# EAGLE design Voltage Reg Comparison (EAGLE 6.5.0)
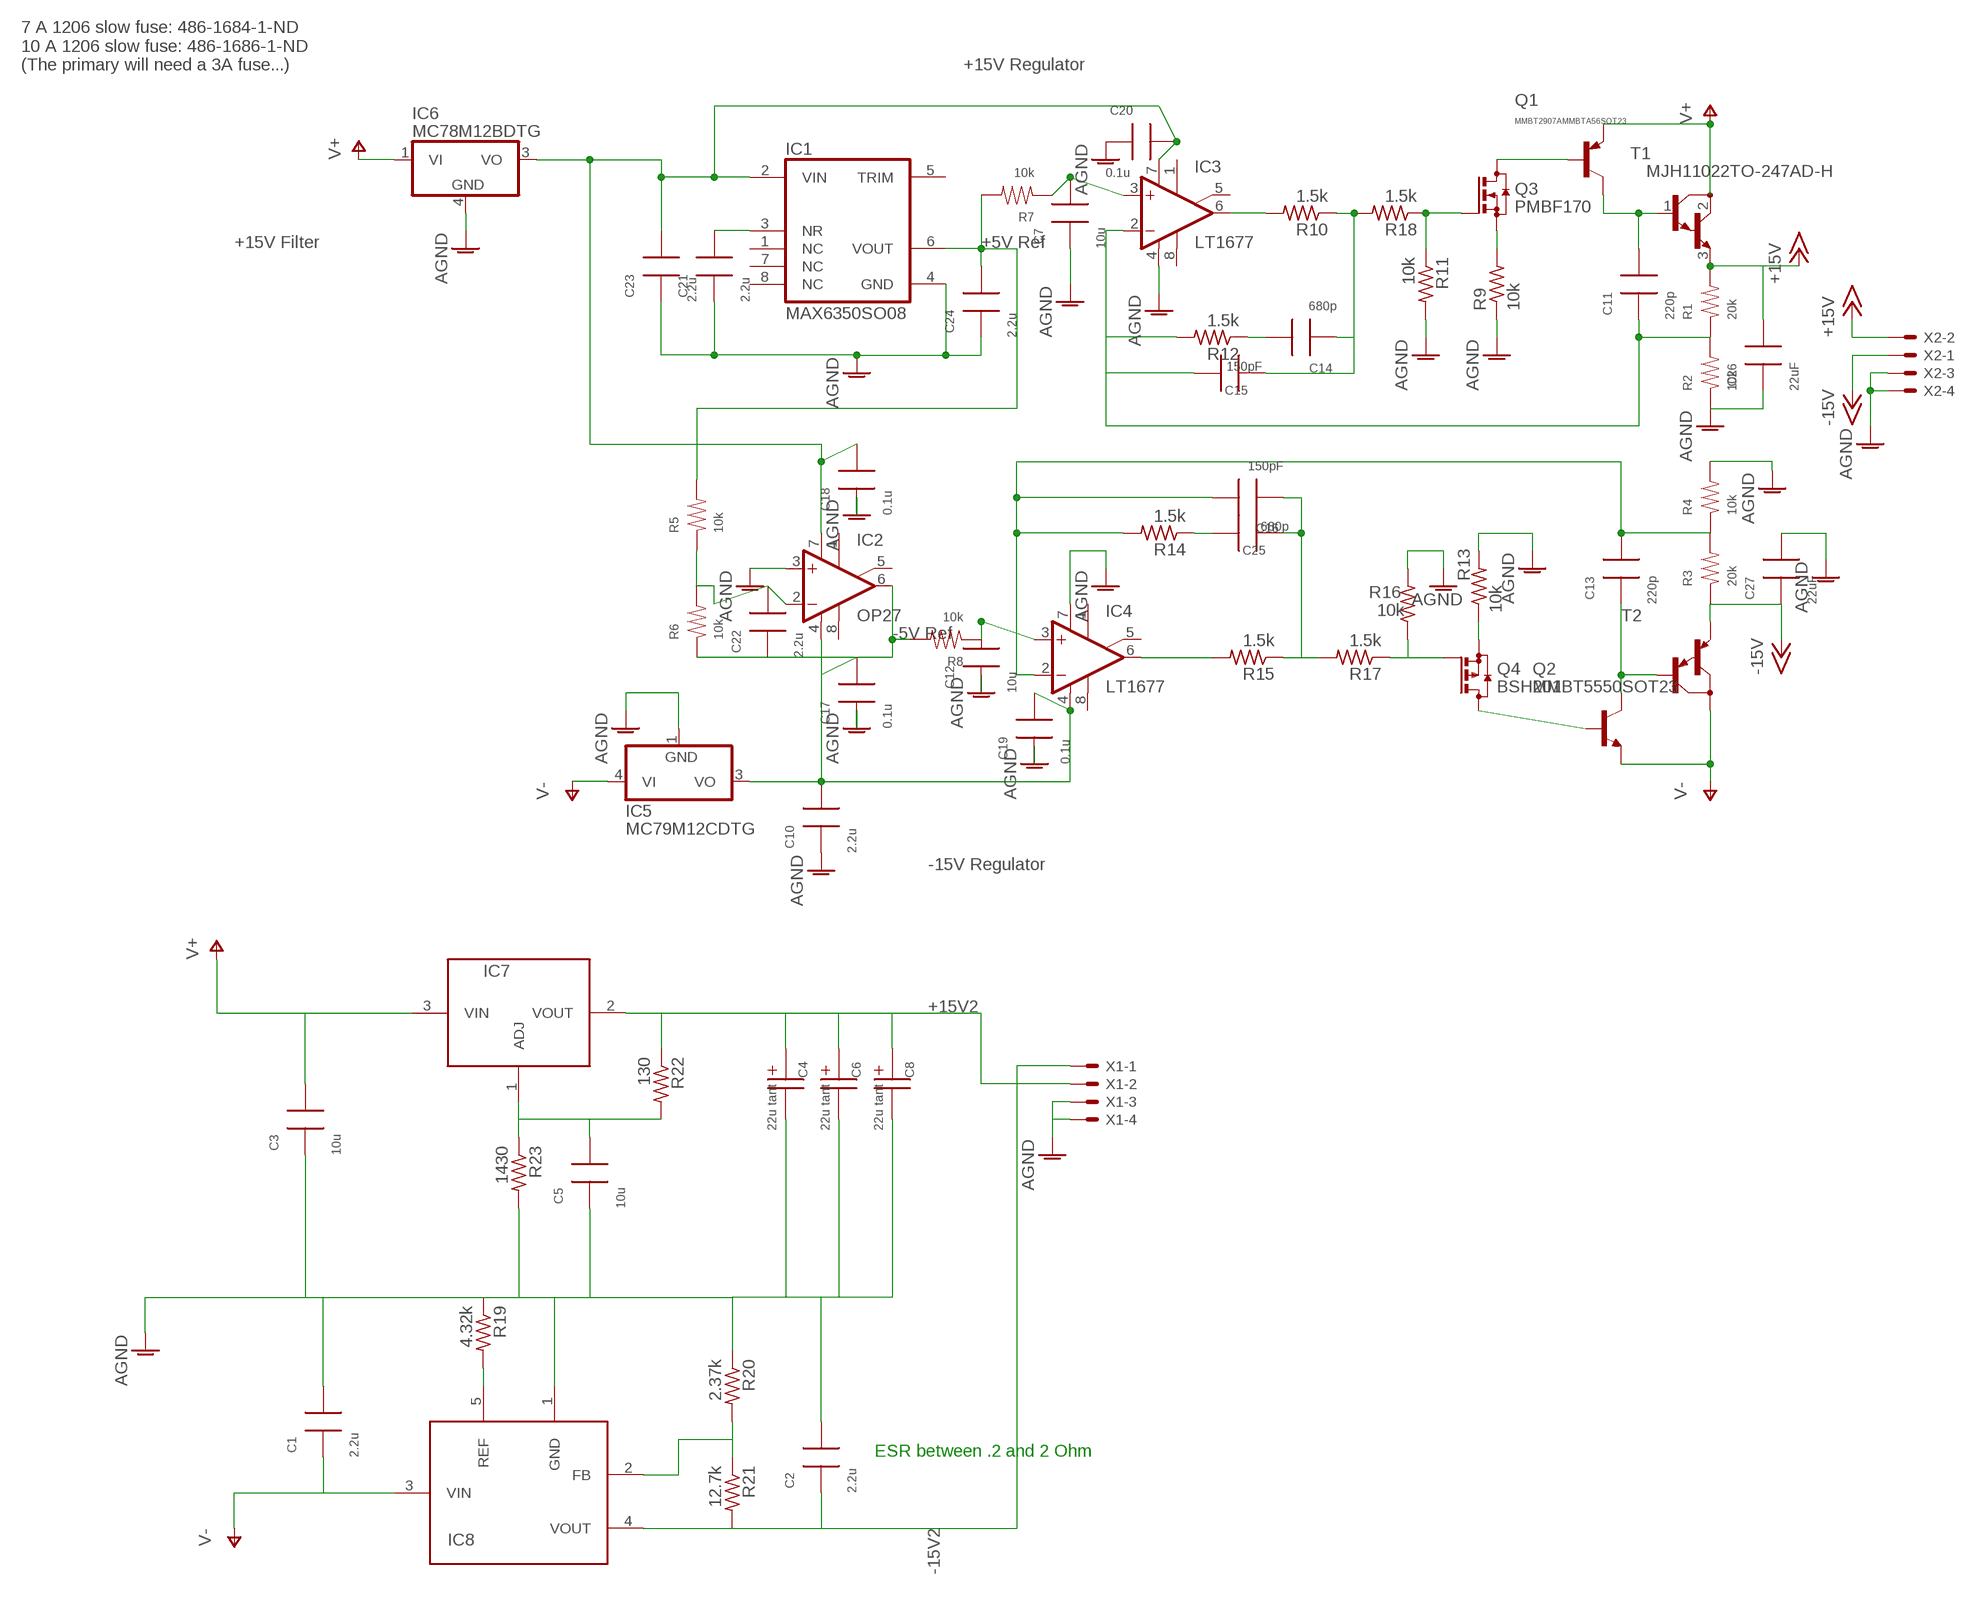
[diagram p0: schematic, sheet 1]

## Parts
C1  2.2u  CAP1206  [1206]
C2  2.2u  CAP1206  [1206]
C3  10u  CAP1206  [1206]
C4  22u tant  CAP-POL1206  [1206P]
C5  10u  CAP1206  [1206]
C6  22u tant  CAP-POL1206  [1206P]
C7  10u  CAP1206  [1206]
C8  22u tant  CAP-POL1206  [1206P]
C10  2.2u  CAP1206  [1206]
C11  220p  CAP1206  [1206]
C12  10u  CAP1206  [1206]
C13  220p  CAP1206  [1206]
C14  680p  CAP1206  [1206]
C15  150pF  CAP1206  [1206]
C16  150pF  CAP1206  [1206]
C17  0.1u  CAP1206  [1206]
C18  0.1u  CAP1206  [1206]
C19  0.1u  CAP1206  [1206]
C20  0.1u  CAP1206  [1206]
C21  2.2u  CAP1206  [1206]
C22  2.2u  CAP1206  [1206]
C23  2.2u  CAP1206  [1206]
C24  2.2u  CAP1206  [1206]
C25  680p  CAP1206  [1206]
C26  22uF  CAP1206  [1206]
C27  22uF  CAP1206  [1206]
IC1  MAX6350SO08  [SO08]
IC2  OP27  OPAMP-SO  [SO08]
IC3  LT1677  OPAMP-SO  [SO08]
IC4  LT1677  OPAMP-SO  [SO08]
IC5  MC79M12CDTG  [DPACK_3]
IC6  MC78M12BDTG  [DPACK_3]
IC7  LM1084TO220  [T03B]
IC8  LT1185TO220/INLINE  [T05A]
Q1  MMBT2907AMMBTA56SOT23  [SOT23]
Q2  MMBT5550SOT23  [SOT23]
Q3  PMBF170  [SOT23]
Q4  BSH201  [SOT23]
R1  20k  RES1206  [1206]
R2  10k  RES1206  [1206]
R3  20k  RES1206  [1206]
R4  10k  RES1206  [1206]
R5  10k  RES1206  [1206]
R6  10k  RES1206  [1206]
R7  10k  RES1206  [1206]
R8  10k  RES1206  [1206]
R9  10k  R-US_R1206  [R1206]
R10  1.5k  R-US_R1206  [R1206]
R11  10k  R-US_R1206  [R1206]
R12  1.5k  R-US_R1206  [R1206]
R13  10k  R-US_R1206  [R1206]
R14  1.5k  R-US_R1206  [R1206]
R15  1.5k  R-US_R1206  [R1206]
R16  10k  R-US_R1206  [R1206]
R17  1.5k  R-US_R1206  [R1206]
R18  1.5k  R-US_R1206  [R1206]
R19  4.32k  R-US_R1206  [R1206]
R20  2.37k  R-US_R1206  [R1206]
R21  12.7k  R-US_R1206  [R1206]
R22  130  R-US_R1206  [R1206]
R23  1430  R-US_R1206  [R1206]
T1  MJH11022TO-247AD-H  [TO-247AD-H]
T2  MJH11021TO-247AD-H  [TO-247AD-H]
X1  5566-4RA  [5566-4-RA]
X2  5566-4RA  [5566-4-RA]

## Nets
+12V: C18.2 C20.2 C23.2 IC1.2(VIN) IC2.7(V+) IC3.7(V+) IC6.3(VO)
+15V: C26.2 R1.2 T1.3(E) X2.2
+15V2: C4.1 C6.1 C8.1 IC7.2(VOUT) R22.1 X1.2
-12V: C10.2 C17.2 C19.2 IC2.4(V-) IC4.4(V-) IC5.3(VO)
-15V: C27.1 R3.1 T2.3(E) X2.1
-15V2: C2.1 IC8.4(VOUT) R21.2 X1.1
AGND: C1.2 C2.2 C3.1 C4.2 C5.1 C6.2 C7.1 C8.2 C10.1 C12.1 C17.1 C18.1 C19.1 C20.1 C21.1 C23.1 C24.1 C26.1 C27.2 IC1.4(GND) IC2.3(+IN) IC3.4(V-) IC4.7(V+) IC5.1(GND) IC6.4(GND) IC8.1(GND) R2.1 R4.2 R9.1 R11.2 R13.2 R16.2 R19.1 R20.1 R23.2 X1.3 X1.4 X2.3 X2.4
N$1: IC8.2(FB) R20.2 R21.1
N$2: C5.2 IC7.1(ADJ) R22.2 R23.1
N$4: C21.2 IC1.3(NR)
N$7: C24.2 IC1.6(VOUT) R5.2 R7.2
N$9: C14.2 R12.1
N$10: C13.1 Q2.3(C) T2.1(B)
N$11: IC3.6(OUT) R10.2
N$12: Q4.1(G) R16.1 R17.1
N$13: C11.2 Q1.3(C) T1.1(B)
N$14: C22.2 IC2.2(-IN) R5.1 R6.2
N$15: C22.1 IC2.6(OUT) R6.1 R8.2
N$16: Q4.2(S) R13.1
N$17: C11.1 C15.2 IC3.2(-IN) R1.1 R2.2 R12.2
N$18: IC4.6(OUT) R15.2
N$19: C7.2 IC3.3(+IN) R7.1
N$20: Q2.1(B) Q4.3(D)
N$21: C12.2 IC4.3(+IN) R8.1
N$22: IC8.5(REF) R19.2
N$23: C13.2 C16.2 IC4.2(-IN) R3.2 R4.1 R14.2
N$25: Q3.1(G) R11.1 R18.1
N$27: C25.2 R14.1
N$28: C16.1 C25.1 R15.1 R17.2
N$33: Q1.1(B) Q3.3(D)
N$34: Q3.2(S) R9.2
N$35: C14.1 C15.1 R10.1 R18.2
V+: IC6.1(VI) Q1.2(E) T1.2(C)
V+2: C3.2 IC7.3(VIN) ; supply symbol labelled V+
V-: IC5.4(VI) Q2.2(E) T2.2(C)
V-2: C1.1 IC8.3(VIN) ; supply symbol labelled V-
Unconnected: IC1.1(NC) IC1.5(TRIM) IC1.7(NC) IC1.8(NC) IC2.1(ON1) IC2.5(ON2) IC2.8(OPT) IC3.1(ON1) IC3.5(ON2) IC3.8(OPT) IC4.1(ON1) IC4.5(ON2) IC4.8(OPT)

## Notes on the sheet
- 7 A 1206 slow fuse: 486-1684-1-ND
  10 A 1206 slow fuse: 486-1686-1-ND
  (The primary will need a 3A fuse...)
- +15V Regulator
- +15V Filter | +5V Ref
- -5V Ref
- -15V Regulator
- ESR between .2 and 2 Ohm

## Library data of the parts
C1-C3 C5 C17-C20 = rlc-jqi:CAP: SMT Capacitor; DIGIKEY: 399-1249-1-ND
C4 C6 C8 = rlc-jqi:CAP-POL: Polarized SMT Capacitor; DIGIKEY: 399-1249-1-ND
C7 C12 = rlc-jqi:CAP: SMT Capacitor; DIGIKEY: 445-12883-2-ND; VMAX: 50
C10 C21-C24 = rlc-jqi:CAP: SMT Capacitor; DIGIKEY: 587-2402-1-ND
C11 C13 = rlc-jqi:CAP: SMT Capacitor; DIGIKEY: 1276-1166-1-ND
C14 C25 = rlc-jqi:CAP: SMT Capacitor; DIGIKEY: 399-8209-1-ND
C15 C16 = rlc-jqi:CAP: SMT Capacitor
C26 C27 = rlc-jqi:CAP: SMT Capacitor; DIGIKEY: 445-8045-1-ND
IC1 = jqi-power-supply:MAX6350: VOLATAGE REFERENCE; DIGIKEY: MAX6350CSA+-ND
IC2 = opamp-jqi:OPAMP: Basic Op Amp. Be sure to check actual pinout of your device, and modify as necessary!; DIGIKEY: OP27GSZ-REEL7CT-ND
IC3 IC4 = opamp-jqi:OPAMP: Basic Op Amp. Be sure to check actual pinout of your device, and modify as necessary!; DIGIKEY: LT1677CS8#PBF-ND
IC5 = linear:MC79M: 500 mA Negative Voltage Regulators Source: Data sheet <http://www.onsemi.com/pub_link/Collateral/MC79M00-D.PDF>; DIGIKEY: MC79M12CDTGOS-ND
IC6 = linear:MC78M: 500 mA Positive Voltage Regulators Source: Data sheet <http://www.onsemi.com/pub_link/Collateral/MC78M00-D.PDF>; DIGIKEY: MC78M12BDTGOS-ND
IC7 = jqi-power-supply:LM1084: Adjustable 5A Positive Voltage Regulator; DIGIKEY: LM1084IT-ADJ/NOPB-ND
IC8 = jqi-power-supply:LT1185: Adjustable Voltage Regulator (positive/negative); DIGIKEY: LT1185CT#06PBF-ND
Q1 = jqi-power-supply:MMBT2907A: PNP Transistor; DIGIKEY: MMBT2907AFSCT-ND
Q2 = jqi-power-supply:MMBT5550: NPN Transistor; DIGIKEY: MMBT5550CT-ND
Q3 = jqi-power-supply:PMBF170: N-CHANNEL MOS FET; DIGIKEY: MMBT2907AFSCT-ND
Q4 = jqi-power-supply:BSH201: P-CHANNEL MOS FET; DIGIKEY: 568-6217-1-ND
R1 R3 = rlc-jqi:RES: SMT Resistor; DIGIKEY: RMCF1206FT20K0CT-ND
R2 R4-R8 = rlc-jqi:RES: SMT Resistor; DIGIKEY: RNCP1206FTD10K0CT-ND
R9 R13 = rcl:R-US_: RESISTOR, American symbol; DIGIKEY: RNCP1206FTD10K0CT-ND
R10-R12 R14-R23 = rcl:R-US_: RESISTOR, American symbol; DIGIKEY: 541-1.5KECT-ND
T1 = jqi-power-supply:MJH11022: NPN POWER DARLINGTON TRANSISTOR 15A, 250V; DIGIKEY: MJH11022GOS-ND
T2 = jqi-power-supply:MJH11021: PNP POWER DARLINGTON TRANSISTOR 15A, 250V; DIGIKEY: MJH11021GOS-ND
X1 X2 = jqi-power-supply:5566-4: Mini FIT connector 4 pol Source: http://www.molex.com; DIGIKEY: WM1352-ND

## Board
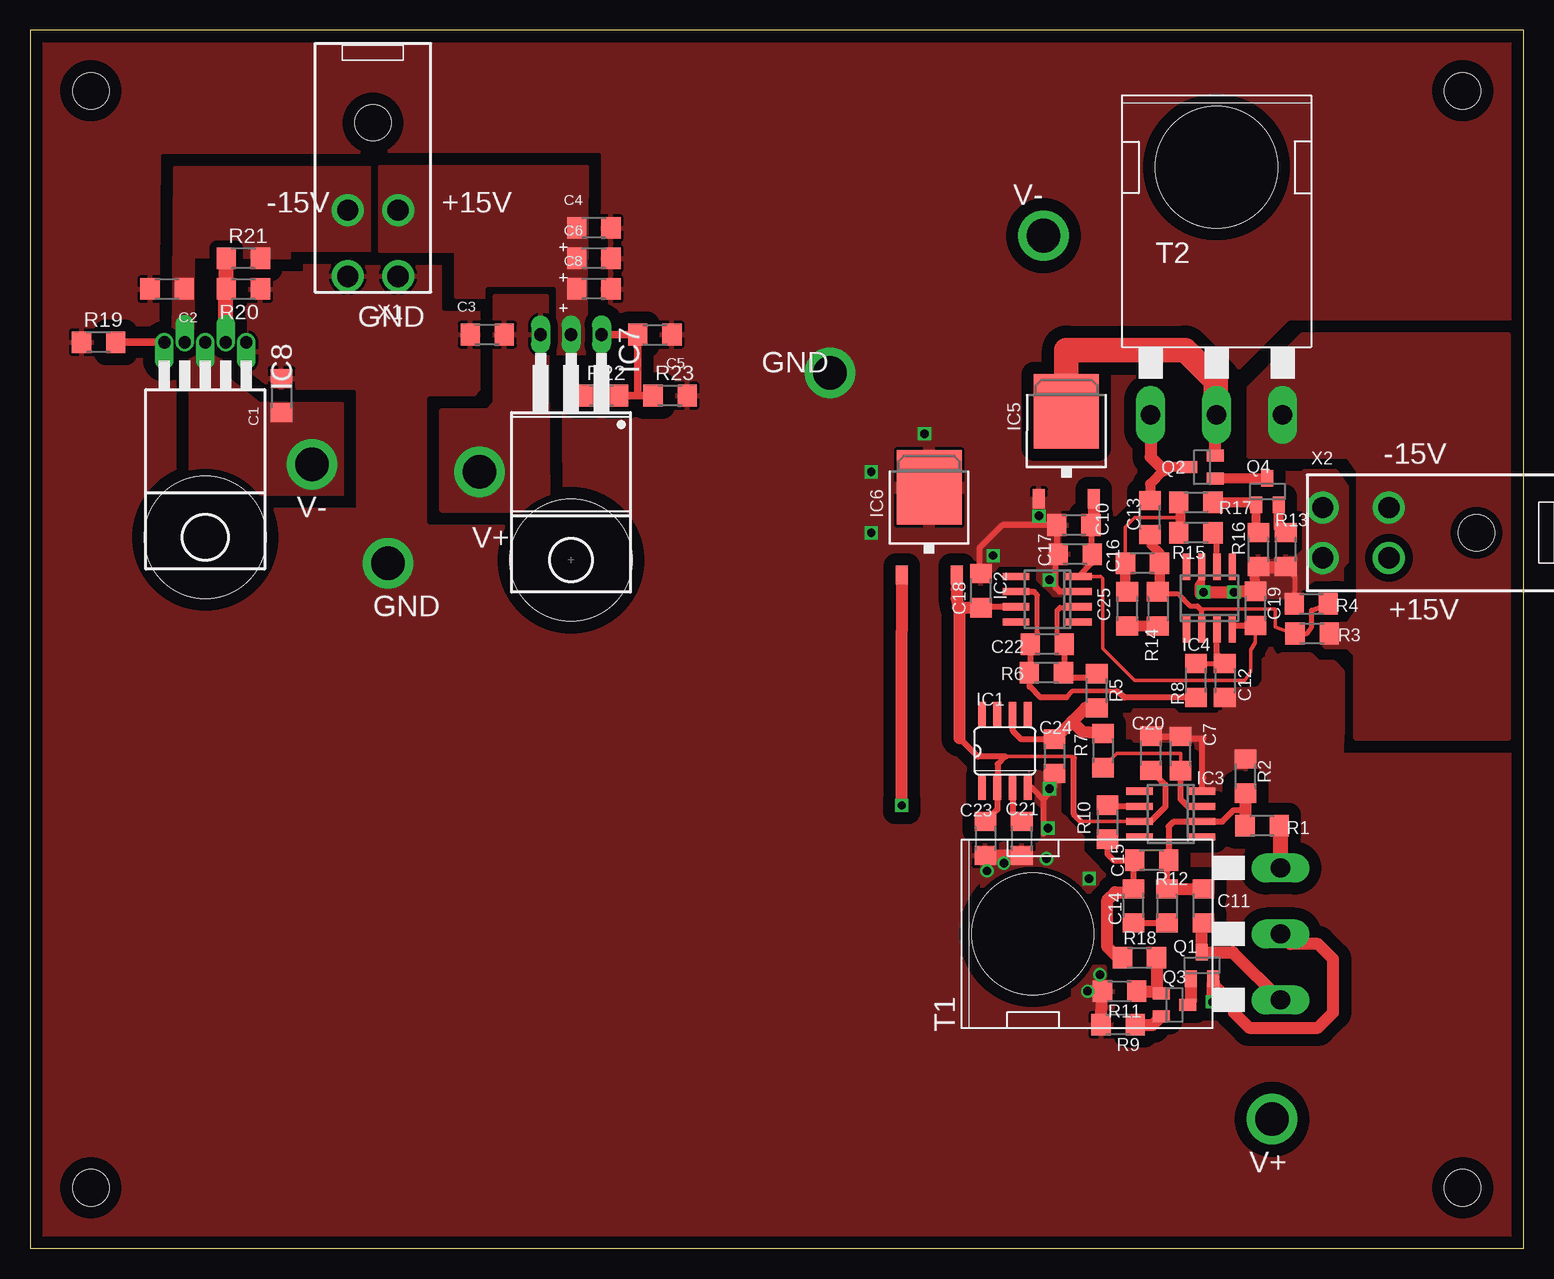
[diagram p1: board, top side]
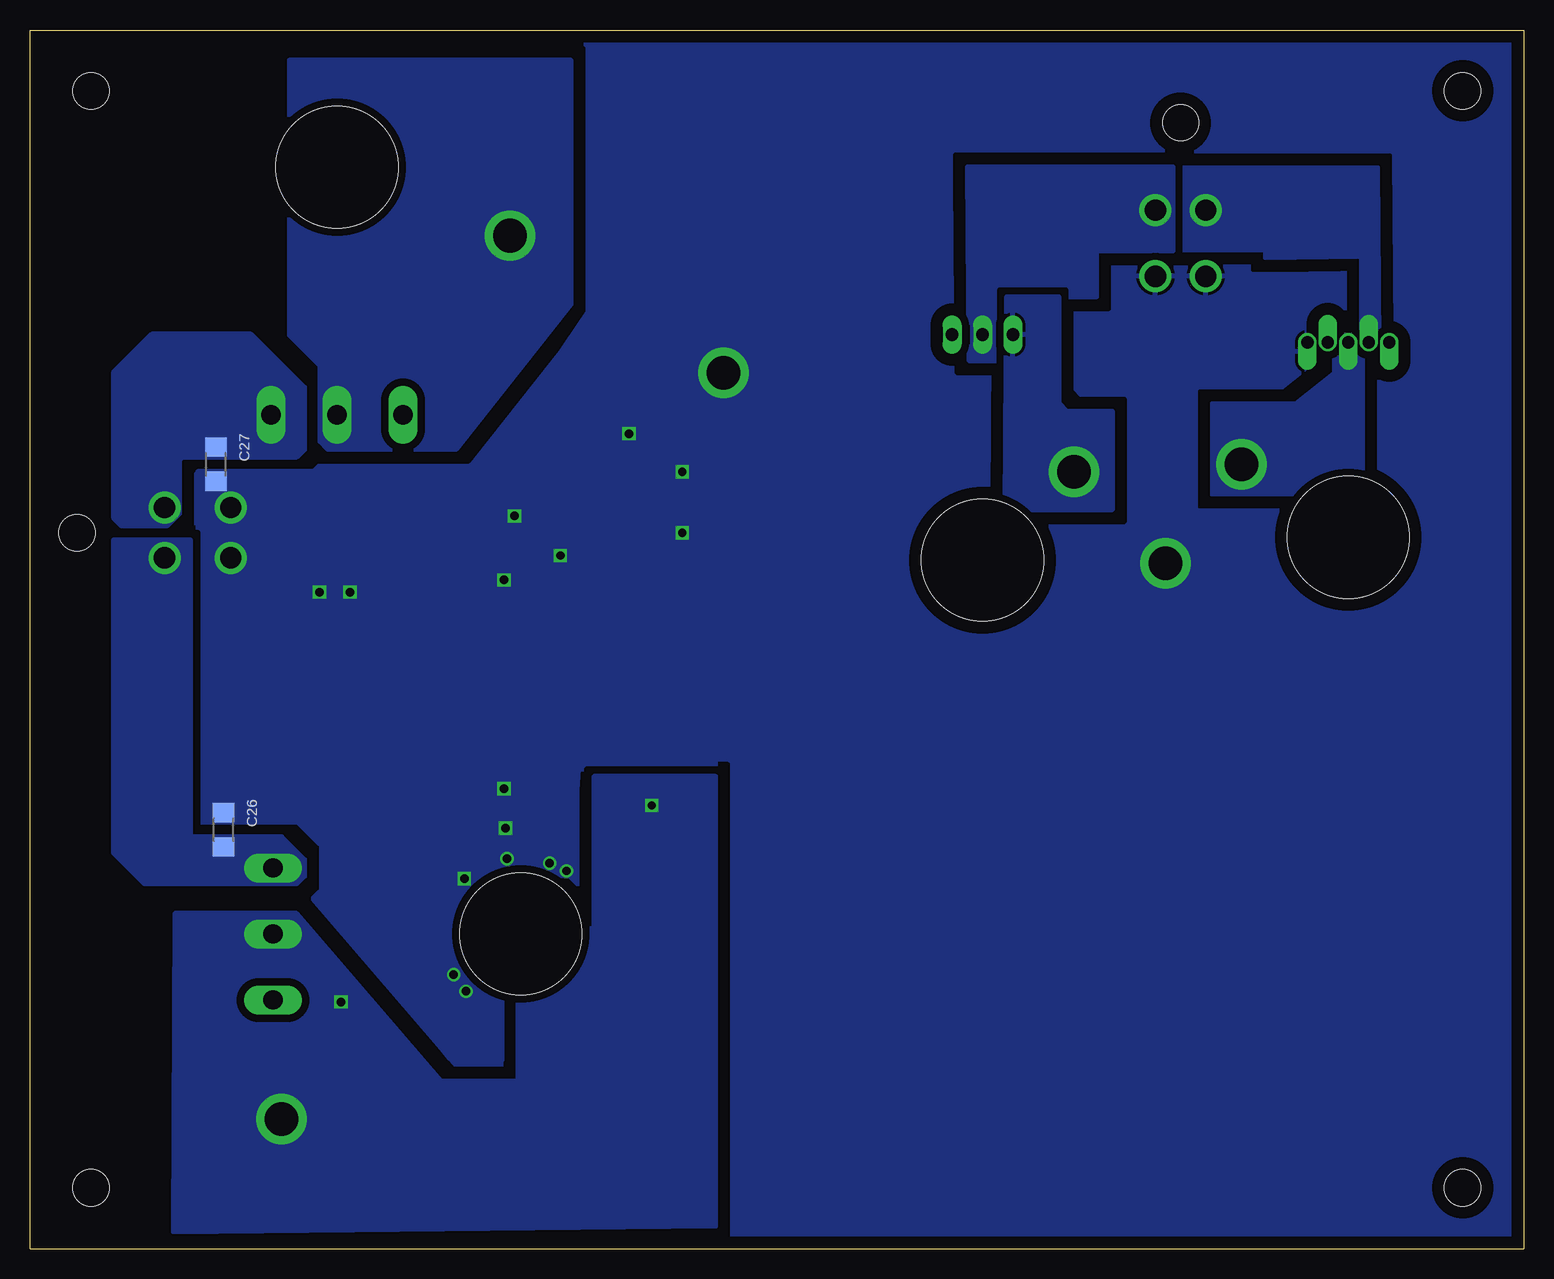
[diagram p2: board, bottom side, seen from below]

Size 124.46 x 101.6 mm. Coordinates in mm from the lower left corner, seen from the top.
Outline: 124.46,0 124.46,101.6 0,101.6 0,0 124.46,0
Copper layers (1+2*15+16): Top 0.0178mm / dielectric 12mil / Route2 0.0356mm / dielectric 28mil / Route15 0.0356mm / dielectric 12mil / Bottom 0.0178mm
Design rules "SSC-EAGLE-4Lyr_v1.0.0.3": minimum track width 6mil, minimum drill 8mil, track to track 6mil, track to pad 6mil, pad to pad 6mil, via to via 6mil, smd to smd 6mil, copper to edge 20mil, drill to drill 16mil, minimum pad ring 8mil, minimum via ring 8mil, stop-mask expansion 3mil, vias tented up to drill 0mil, thermal gap 10mil
Holes 3.05 mm at 119.38,5.08 119.38,96.52 5.08,96.52 5.08,5.08

### Footprints (pad centres in the part's own frame; a part is rotated, then mirrored left to right if it is on the bottom)
1206 = smd 1.6 x 1.803: 1 -1.422,0; 2 1.422,0
1206P = smd 1.6 x 1.803: 1 -1.422,0; 2 1.422,0
SO08 = smd 0.66 x 2.032: 1 -1.905,-3.073; 2 -0.635,-3.073; 3 0.635,-3.073; 4 1.905,-3.073; 5 1.905,3.073; 6 0.635,3.073; 7 -0.635,3.073; 8 -1.905,3.073
SO08' = smd 2.2 x 0.6: 1 -2.6,1.27; 2 -2.6,0; 3 -2.6,-1.27; 4 -2.6,-2.54; 5 2.6,-2.54; 6 2.6,-1.27; 7 2.6,0; 8 2.6,1.27
DPACK_3 = smd 1 x 1.6: 1 -2.28,-4.8; 3 2.28,-4.8 | smd 5.4 x 6.2: 4 0,2.5
T03B = drill 1.067 long: 1 -2.54,-11.43; 2 0,-11.43; 3 2.54,-11.43 | hole 10.16: 0,7.366
T05A = drill 1.016 offset: 1 -3.404,-8.89; 2 -1.702,-8.89; 3 0,-8.89; 4 1.702,-8.89; 5 3.404,-8.89 | hole 10.16: 0,7.366
SOT23 = smd 1 x 1.4: 1 -0.95,-1.1; 2 0.95,-1.1; 3 0,1.1
R1206 = smd 1.6 x 1.803: 1 -1.422,0; 2 1.422,0
TO-247AD-H = drill 1.6 long: 1 -5.5,-20.65; 2 0,-20.65; 3 5.5,-20.65 | hole 10.16: 0,0
5566-4-RA = drill 1.778: 1 2.095,-2.756; 2 -2.095,-2.756; 3 2.095,2.756; 4 -2.095,2.756 | hole 3: 0,-10.046

### Placement (x,y rotation side)
C1  20.95,71.12 90 top
C2  11.43,80.01 180 top
C3  38.1,76.2 0 top
C4  46.99,85.09 0 top
C5  52.07,76.2 180 top
C6  46.99,82.55 0 top
C7  95.89,41.27 270 top
C8  46.99,80.01 0 top
C10  87,60.33 0 top
C11  97.79,28.57 270 top
C12  99.57,47.37 90 top
C13  93.34,60.96 270 top
C14  91.95,28.57 270 top
C15  93.47,32.38 0 top
C16  92.71,57.15 0 top
C17  87.1,57.9 0 top
C18  79.24,54.85 270 top
C19  102.14,53.38 270 top
C20  93.42,41.3 270 top
C21  82.64,34.21 90 top
C22  84.77,50.4 0 top
C23  79.62,34.21 90 top
C24  85.36,41.05 90 top
C25  91.44,53.34 270 top
C26  108.33,34.92 270 bottom
C27  108.97,65.41 270 bottom
IC1  81.24,41.49 0 top
IC2  OP27  [SO08']  84.78,53.51 180 top
IC3  LT1677  [SO08']  95.06,35.61 180 top
IC4  LT1677  [SO08']  97.64,54.23 90 top
IC5  86.36,67.31 0 top
IC6  74.93,60.96 0 top
IC7  45.09,64.77 180 top
IC8  14.61,66.67 180 top
Q1  97.66,23.62 0 top
Q2  97.66,65.15 90 top
Q3  95.38,20.32 270 top
Q4  103.12,63.12 0 top
R1  102.68,35.26 0 top
R2  101.3,39.4 270 top
R3  106.84,51.29 180 top
R4  106.77,53.76 180 top
R5  88.9,46.5 270 top
R6  84.7,48.01 0 top
R7  89.41,41.53 90 top
R8  97.16,47.37 270 top
R9  90.68,18.67 0 top
R10  89.79,35.56 90 top
R11  90.81,21.46 180 top
R12  94.74,28.57 90 top
R13  104.65,58.29 270 top
R14  93.98,53.34 90 top
R15  97.16,59.69 0 top
R16  102.36,58.29 270 top
R17  97.16,62.23 180 top
R18  92.46,24.26 180 top
R19  5.71,75.56 0 top
R20  17.78,80.01 180 top
R21  17.78,82.55 0 top
R22  47.62,71.12 0 top
R23  53.34,71.12 0 top
T1  83.56,26.25 90 top
T2  98.88,90.17 0 top
X1  28.57,83.82 180 top
X2  110.49,59.69 90 top

### Tracks (layer width: path | path; a pad name or v marks a point on that pad's centre or on a via)
+12V
  Top 0.305: IC3.7 87.58,35.61 | 87,40.89 86.87,41.02 81.28,41.02
  Top 0.508: C20.2 94.61,38.68 94.61,36.83 93.34,35.56 93.3,35.61 IC3.7 | 79.56,35.69 C23.2 80.61,36.62 IC1.2 80.64,38.46 80.64,40.39 81.28,41.02 78.99,41.02 77.47,42.55 | IC2.7 79.32,53.51 C18.2 | 87.58,35.61 87,36.2 87,40.89
  Top 1.016: IC6.3 77.22,54.99 77.22,54.23 77.34,53.47 77.47,53.47 | 77.47,53.47 79.21,53.47 C18.2 | 77.47,42.55 77.47,53.47
+15V
  Top 1.27: T1.3 104.21,35.15 R1.2
  pour Bottom (no thermals): 111.12,59.05 117.47,59.05 117.47,33.02 114.94,30.48 102.23,30.48 101.6,31.11 101.6,32.38 103.5,34.29 111.12,34.29
+15V2
  Top 0.61: IC7.2 45.09,72.24 R22.1
  pour Bottom (isolate 0.61, rank 2, no thermals): 43.31,74.04 43.43,79.38 35.56,79.38 35.56,83.19 29.21,83.19 29.21,90.17 46.35,90.17 46.23,74.04
  pour Top (isolate 0.61, rank 2, no thermals): 43.31,74.68 43.43,79.38 35.56,79.38 35.56,83.19 29.21,83.19 29.21,90.17 46.35,90.17 46.23,74.68
-12V
  Top 0.305: C19.2 102.11,50.55 101.73,49.91 101.73,48.13 101.22,47.37 92.08,47.37 89.41,50.04 89.41,55.88 89.24,56.05 IC2.4
  Top 0.508: 101.95,51.63 C19.2 100.2,51.94 IC4.4 | IC2.4 88.52,57.19 C17.2 88.42,58 C10.2
  Top 1.016: IC5.3 88.65,60.83 88.42,60.83 C10.2
-15V
  pour Bottom (no thermals): 101.6,66.67 101.6,71.75 106.05,76.2 114.3,76.2 117.47,73.03 117.47,60.96 116.84,60.33 113.03,60.33 112.01,61.34 112.01,65.79 111.76,66.04 102.23,66.04
  pour Top (isolate 0.635, no thermals): 107.95,52.07 109.86,52.07 110.74,53.34 110.74,64.77 109.86,66.04 101.6,66.04 101.6,71.75 106.05,76.2 123.19,76.2 123.19,42.55 110.49,42.55 110.49,49.53 109.86,50.16 107.95,50.16
-15V2
  pour Bottom (isolate 0.61, rank 3, no thermals): 11.94,75.31 12.06,90.17 28.57,90.17 28.57,83.19 21.59,83.19 21.59,82.55 13.59,82.68 13.59,75.31
  pour Top (isolate 0.61, rank 3, no thermals): 11.94,75.31 12.06,90.17 28.57,90.17 28.57,83.19 21.59,83.19 21.59,82.55 13.59,82.68 13.59,75.31
AGND  (via drill 0.7, 2.8)
  Top 0.406: 104.36,56.84 105.41,56.01 R4.2 | 97.66,54.74 97.41,54.36 97.28,54.48 97.28,55.37 97.54,55.75
  Top 0.508: 100.52,54.8 v100.33,54.74 | IC4.7 97.64,55.65 97.66,54.74 | C20.1 93.44,42.7 C7.1 96.04,42.55 97.79,42.55 97.67,42.42 97.67,39.37 | 97.67,39.37 IC3.4 | 97.79,39.24 97.67,39.37 | IC1.4 83.5,38.42 84.45,37.47 | 84.45,37.47 84.45,34.6 | C24.1 85.36,38.5 84.45,37.47 | IC2.3 85.81,54.78 85.47,55.12 85.47,57.69 C17.1 85.57,58 C10.1 81.03,60.33 79.12,58.42 79.12,56.4 C18.1
  Top 0.813: C19.1 102.01,56.84 R16.2
  Top 1.016: C19.1 100.52,54.8 | 97.66,54.74 v100.33,54.74 | 102.01,56.84 104.36,56.84 R13.2 | R9.1 89.31,21.36 v88.14,21.46 R11.2 | C23.1 C21.1
  other vias: 97.79,54.74 80.26,57.78 84.07,61.09 84.96,55.75 89.15,22.86 70.1,59.69 70.1,64.77 74.55,67.94 84.96,38.35 79.76,31.5 81.15,32.13 84.71,32.51 84.84,35.05 88.27,30.86 29.84,57.15 66.67,73.03
  pour Bottom (isolate 0.635, rank 3, no thermals): 78.74,40.01 67.31,40.01 67.31,69.85 60.33,69.85 60.33,79.38 77.09,79.38 87,64.77 110.49,64.77 110.49,35.56 99.69,35.56 99.69,28.57 89.53,15.88 85.09,15.75 85.09,31.11 79.38,31.11
  pour Top (no thermals): 98.81,46.61 100.84,46.61 102.87,46.74 102.87,49.15 103.5,49.15 104.39,49.53 106.68,49.53 107.31,48.9 108.58,48.9 109.35,48.13 109.35,43.31 109.09,38.61 103.5,38.61 103.5,40.13 99.82,40.26 99.82,46.23
  pour Top (no thermals): 102.23,57.02 102.11,54.36 105.28,54.36 106.81,55.88 108.46,55.88 109.73,57.28 109.73,63.5 108.84,64.77 106.17,64.77 106.17,58.17 105.54,57.53 104.65,57.53
  pour Top (no thermals): 79.38,56.52 79.38,58.42 82.55,62.23 85.72,62.23 85.72,57.66 85.34,57.28 85.34,55.37 85.85,54.86 85.85,54.48 85.34,54.48 84.07,55.75 84.07,56.9 83.95,57.02 80.64,57.02 80.14,56.52
  pour Top (no thermals): 100.97,40.64 100.97,40.13 99.31,40.13 98.93,39.75 98.93,38.61 98.55,38.23 97.79,38.23 97.79,41.66 97.03,42.42 92.08,42.42 91.95,43.81 91.95,44.07 92.08,44.83 95.25,44.83 95.63,44.45 100.58,44.45 100.58,41.02
  pour Top (no thermals): 89.53,20.32 87,20.32 87,23.5 89.53,23.5
  pour Top: 83.57,61.98 81.41,61.98 79.5,63.75 79.5,68.33 72.14,68.33 69.34,65.15 69.34,59.05 69.85,58.93 80.52,58.93
  pour Top (no thermals): 79.38,33.02 79.38,28.57 87.63,28.57 87.63,29.21 88.9,30.48 88.9,31.75 87.63,33.02 87.63,34.29 86.11,35.94 85.72,36.2 85.72,39.37 83.95,39.37 83.95,37.34 84.45,36.83 84.45,32.89 79.76,32.77
  pour Top (isolate 1.016, rank 4): 134.62,113.03 -12.06,112.39 -10.16,-13.97 135.89,-13.97
  pour Bottom (isolate 1.016, rank 5): 144.78,112.39 -12.7,113.67 -10.79,-12.7 146.05,-14.61
N$1
  Top 1.27: R21.1 R20.2 16.31,79.96 IC8.2
N$2
  Top 0.61: IC7.1 C5.2 50.65,71.27 50.8,71.12 | R22.2 50.8,71.12 | 50.8,71.12 R23.1
N$4
  Top 0.508: IC1.3 81.88,36.4 C21.2
N$7
  Top 0.508: C24.2 82.62,42.47 81.92,43.18 81.92,44.52 IC1.6
  Top 1.016: R5.2 87.97,45.08 86.85,43.96 | 86.85,43.96 C24.2 | R7.2 87.73,43.08 86.85,43.96
N$9
  Top 0.508: C14.2 R12.1
N$10
  Top 0.813: Q2.3 94.74,65.15 94.49,64.9 93.34,63.75 C13.1
  Top 1.016: T2.1 93.38,66.01 94.49,64.9
N$11
  Top 0.508: IC3.6 92.44,36.85 89.79,36.85 R10.2
N$12
  Top 0.762: R16.1 102.17,59.72 Q4.1
  Top 0.813: 101.98,61.83 Q4.1 101.96,62.23 R17.1
N$13
  Top 1.016: C11.2 97.66,27.03 Q1.3 100.23,24.72 T1.1
N$14
  Top 0.406: C22.2 86.19,50.46 85.6,51.05 85.6,53.21 85.85,53.47 87.34,53.47 IC2.2
  Top 0.508: C22.2 86.19,48.08 R6.2 86.36,47.78 86.36,47.62 88.09,47.62 R5.1
N$15
  Top 0.381: 90.55,46.48 86.87,46.48 86.36,45.97
  Top 0.406: 83.19,50.56 83.2,50.56 83.95,51.31 83.95,54.48 83.65,54.78
  Top 0.508: 82.95,50.8 83.19,50.56 C22.1 83.35,48.08 R6.1 83.31,47.98 83.31,46.86 84.2,45.97 86.36,45.97 | IC2.6 83.65,54.78 | R8.2 91.21,45.95 90.55,46.48
N$16
  Top 0.813: R13.1 104.07,60.03 Q4.2
N$17
  Top 0.508: R12.2 94.74,32.23 C15.2 94.89,35.2 95.25,35.56 97.61,35.56 IC3.2 99.36,35.61 100.33,36.58 101.25,36.58
  Top 1.016: R2.2 101.25,37.98 101.25,36.58 R1.1 | R12.2 C11.1
N$18
  Top 0.508: IC4.6 98.91,59.36 R15.2
N$19
  Top 0.305: C7.2 95.89,41.27 90.58,41.27 R7.1
  Top 0.508: IC3.3 96.47,36.88 95.89,37.47 C7.2
N$20
  Top 0.813: Q4.3 103.11,64.2 Q2.1
N$21
  Top 0.406: R8.1 C12.2
  Top 0.508: 99.57,49.02 98.91,49.55 IC4.3
  Top 0.813: C12.2 99.57,49.02
N$22
  Top 0.61: IC8.5 R19.2
N$23
  Top 0.305: 97.66,53.21 97.79,53.34 103.76,53.34 103.76,51.82 104.78,51.44
  Top 0.406: 94.13,54.61 95.63,54.61 96.65,53.59 97.28,53.59 97.66,53.21 97.66,51.66 IC4.2 | 105.27,51.44 R3.2 | 104.78,51.44 R3.2 | R3.2 106.43,51.31 106.81,51.82 106.81,53.21 R4.1
  Top 0.508: 94.13,54.61 R14.2
  Top 0.813: C13.2 93.47,59.41 93.47,58.67 94.13,58.01 C16.2
  Top 0.889: C16.2 94.13,54.91 R14.2
N$25
  Top 1.016: R18.1 93.88,21.67 | 93.88,21.67 Q3.1 | R11.1 93.67,21.46 93.88,21.67
N$27
  Top 0.889: R14.1 C25.2
N$28
  Top 0.305: 95.89,60.96 92.08,60.96 91.29,60.17 C16.1
  Top 0.813: R15.1 95.89,59.84 95.89,60.96 95.89,62.08 R17.2
  Top 0.889: C16.1 91.29,54.91 C25.1
N$33
  Top 1.016: Q1.1 96.71,20.56 Q3.3
N$34
  Top 1.016: R9.2 93.55,18.64 Q3.2
N$35
  Top 0.508: R10.1 89.79,32.89 90.3,32.38 C15.1 91.95,32.28 C14.1
  Top 1.016: R18.2 90.68,24.26 89.79,25.15 89.79,29.08 90.42,29.72 91.67,29.72 C14.1
V+  (via drill 0.7, 2.8)
  Top 1.016: Q1.2 98.61,22.04 100.33,20.32 100.33,19.68 101.6,18.41 107.31,18.41 108.58,19.68 108.58,24.13 107.31,25.4 105.06,25.4 T1.2 | v98.55,20.57 98.55,22.1 98.68,22.23 | IC6.1 72.65,52.71 72.64,51.44 v72.64,36.96
  other vias: 103.5,10.79
  pour Bottom (isolate 0.635, no thermals): 67.31,1.91 67.31,39.37 77.47,39.37 77.47,26.67 83.82,26.67 83.82,13.97 90.17,13.97 102.23,27.94 112.39,27.94 112.52,1.4
V+2  (via drill 2.8)
  other vias: 37.47,64.77
  pour Bottom (isolate 0.61): 43.18,61.59 43.05,79.38 38.73,79.38 38.73,70.48 38.1,69.85 34.29,69.85 34.29,61.59
  pour Top (isolate 0.61): 43.18,61.59 43.05,79.38 38.73,79.38 38.73,70.48 38.1,69.85 34.29,69.85 34.29,61.59
V-  (via drill 2.8)
  Top 1.016: Q2.2 98.76,69.41 T2.2
  Top 2.032: IC5.4 86.36,74.93 96.27,74.93 98.81,72.39 98.81,69.59 T2.2
  other vias: 84.45,84.45
  pour Bottom (isolate 0.635, rank 2, no thermals): 102.87,99.06 102.87,76.2 100.33,73.66 100.33,67.31 99.69,66.67 88.9,66.67 79.38,78.74 79.38,99.06
V-2  (via drill 2.8)
  other vias: 23.5,65.41
  pour Bottom (isolate 0.61, rank 4, no thermals): 26.04,70.48 26.04,62.87 13.34,62.87 13.34,76.2 15.88,76.2 15.88,73.03 19.05,70.48
  pour Top (isolate 0.61, rank 3, no thermals): 26.04,70.48 26.04,62.87 13.34,62.87 13.34,76.2 15.88,76.2 15.88,73.03 19.05,70.48

### Text on the board
tNames: V- | -15V | +15V | GND | GND | -15V | V- | V+ | GND | +15V | V+